# Altium schematic sheet MS1050_EVB_V2.0.SchDoc
size 381 x 203 mm; SheetNumber: 1; SheetTotal: 1
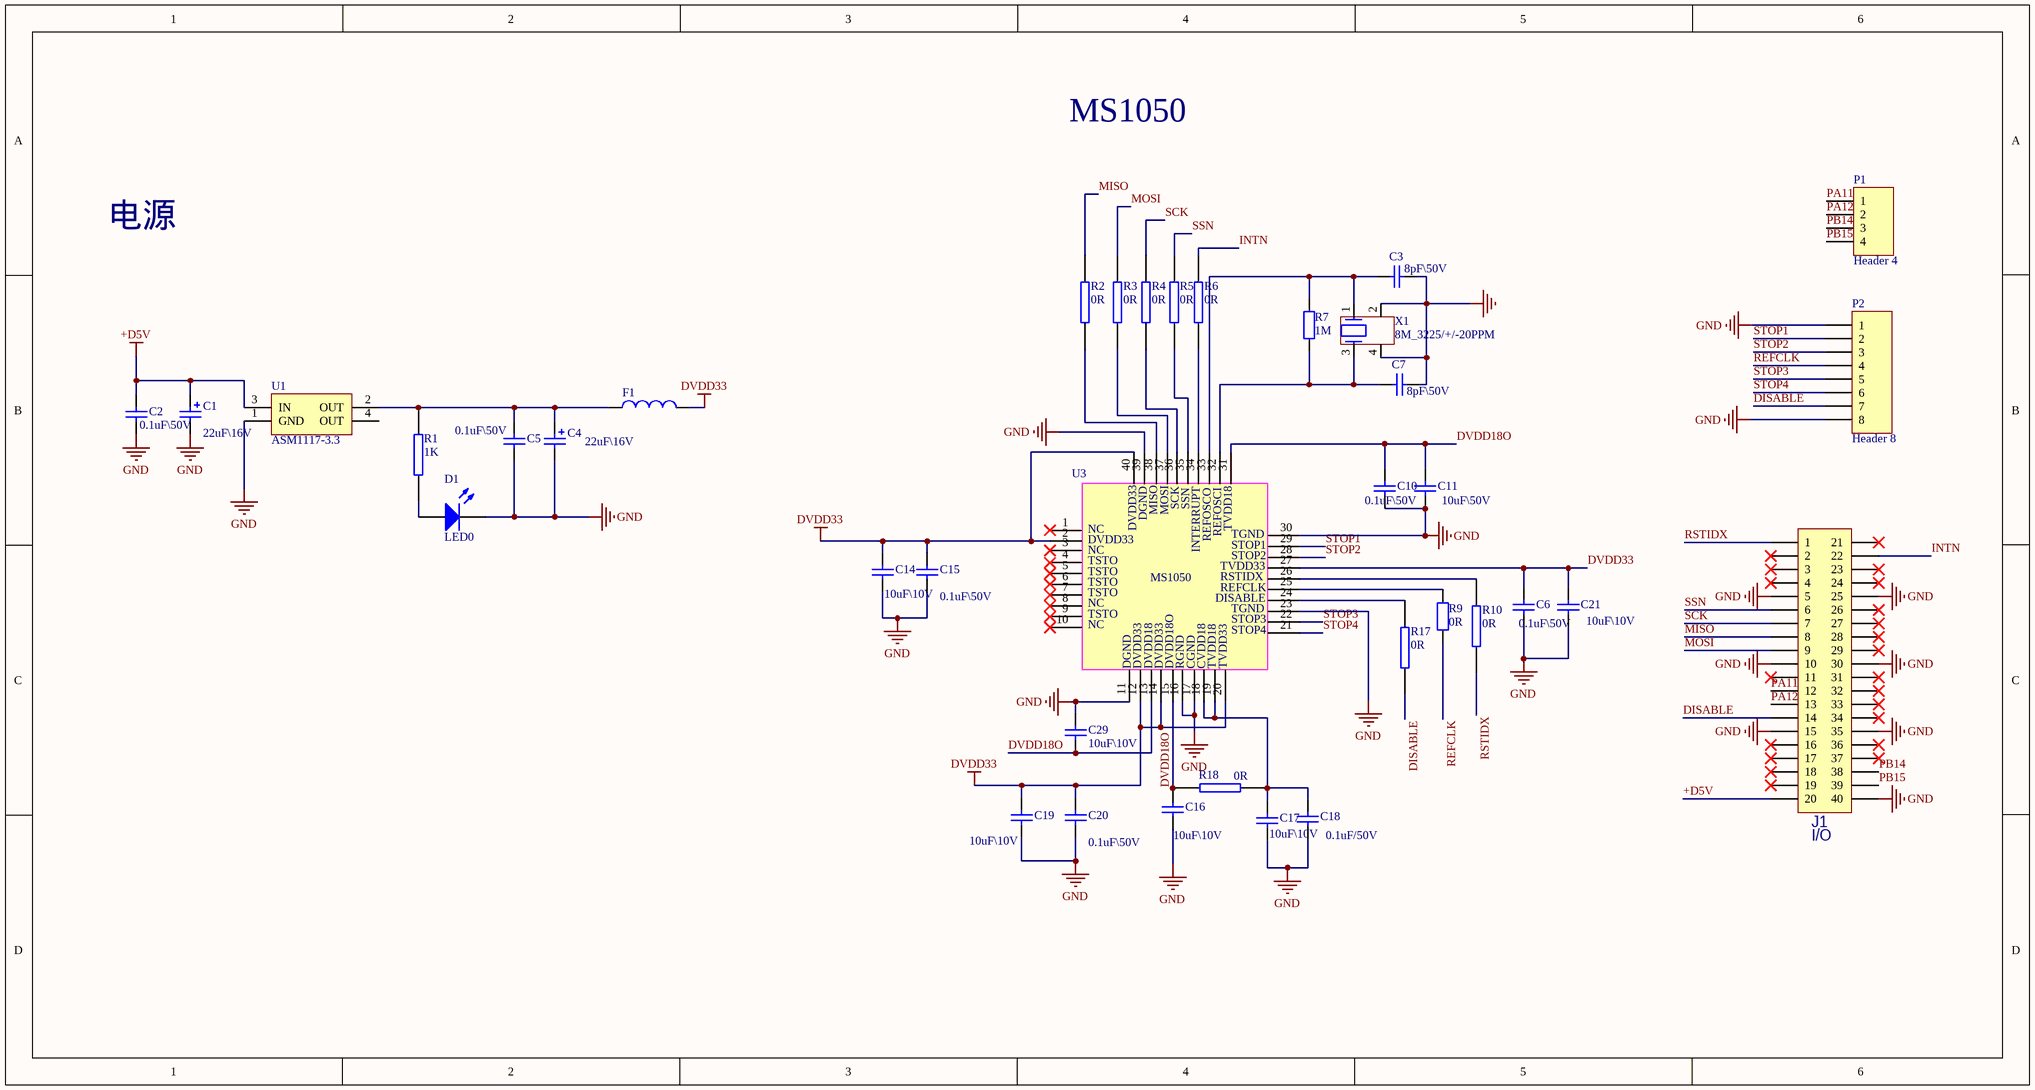
[diagram p0: MS1050_EVB_V2.0.SchDoc]

## Parts
C1  value 22uF\16V  [3216]  (hidden comment: 22uF)
C2  value 0.1uF\50V  [0603C]  (hidden comment: 0.1uF)
C3  value 8pF\50V  [0603C]  (hidden comment: 8pF)
C4  value 22uF\16V  [3216]  (hidden comment: 22uF)
C5  value 0.1uF\50V  [0603c]  (hidden comment: 0.1uF)
C6  value 0.1uF\50V  [0603c]  (hidden comment: 0.1uF)
C7  value 8pF\50V  [0603C]  (hidden comment: 8pF)
C10  value 0.1uF\50V  [0603c]  (hidden comment: 0.1uF)
C11  value 10uF\50V  [0603c]  (hidden comment: 10uF)
C14  value 10uF\10V  [0603c]  (hidden comment: 10uF)
C15  value 0.1uF\50V  [0603c]  (hidden comment: 0.1uF)
C16  value 10uF\10V  [0603c]  (hidden comment: 10uF)
C17  value 10uF\10V  [0603c]  (hidden comment: 10uF)
C18  value 0.1uF/50V  [0603c]  (hidden comment: 0.1uF)
C19  value 10uF\10V  [0603c]  (hidden comment: 10uF)
C20  value 0.1uF\50V  [0603c]  (hidden comment: 0.1uF)
C21  value 10uF\10V  [0603c]  (hidden comment: 10uF)
C29  value 10uF\10V  [0603c]  (hidden comment: 10uF)
D1  LED0  [LED 0603R]
F1  (no value)  [R0603]
J1  I/O  [SIP20x2B]
P1  Header 4  [HDR1X4]
P2  Header 8  [HDR1X8]
R1  1K  [R0603]
R2  0R  [R0603]
R3  0R  [R0603]
R4  0R  [R0603]
R5  0R  [R0603]
R6  0R  [R0603]
R7  1M  [R0603]
R9  value 0R  [R0603]  (hidden comment: Res2)
R10  0R  [R0603]
R17  0R  [R0603]
R18  0R  [R0603]
U1  ASM1117-3.3  [1117]
U3  MS1050  [QFN40 6X6_L]
X1  value 8M_3225/+/-20PPM  [OSC 4025-4P]  (hidden comment: XTAL_4_PINS)

## Nets
+D5V: C1.1 C2.2 J1.20 U1.3(IN)
DVDD33: C6.1 C14.2 C15.2 C19.2 C20.2 C21.1 F1.2 U3.2 U3.12 U3.14 U3.20 U3.27 U3.40
GND: C1.2 C2.1 C3.2 C4.2 C5.1 C6.2 C7.2 C10.1 C11.2 C14.1 C15.1 C16.1 C17.1 C18.1 C19.1 C20.1 C21.2 C29.2 D1.2(K) J1.5 J1.10 J1.15 J1.25 J1.30 J1.35 J1.40 P2.1 P2.8 U1.1(GND) U3.11 U3.16 U3.17 U3.23 U3.30 U3.39 X1.2 X1.4
DISABLE: J1.14 P2.7 R17.2
DVDD18O: C10.2 C11.1 C16.2 C29.1 R18.1 U3.13 U3.15 U3.31
INTN: J1.22 R6.2
MISO: J1.8 R2.2
MOSI: J1.9 R3.2
PA11: J1.12 P1.1
PA12: J1.13 P1.2
PB14: J1.38 P1.3
PB15: J1.39 P1.4
REFCLK: P2.4 R9.1
RSTIDX: J1.1 R10.2
SCK: J1.7 R4.2
SSN: J1.6 R5.2
STOP1: P2.2 U3.29
STOP2: P2.3 U3.28
STOP3: P2.5 U3.22
STOP4: P2.6 U3.21
NetC3_1: C3.1 R7.1 U3.33 X1.1
NetC4_1: C4.1 C5.2 F1.1 R1.1 U1.2(OUT)
NetC7_1: C7.1 R7.2 U3.32 X1.3
NetC17_2: C17.2 C18.2 R18.2 U3.18 U3.19
NetD1_1: D1.1(A) R1.2
NetR2_1: R2.1 U3.38
NetR3_1: R3.1 U3.37
NetR4_1: R4.1 U3.36
NetR5_1: R5.1 U3.35
NetR6_1: R6.1 U3.34
NetR9_2: R9.2 U3.25
NetR10_1: R10.1 U3.26
NetR17_1: R17.1 U3.24

Not connected (* = marked no-connect by the designer): J1 2* 3* 4* 11* 16* 17* 18* 19* 21* 23* 24* 26* 27* 28* 29* 31* 32* 33* 34* 36* 37*; U1 4(OUT); U3 1* 3* 4* 5* 6* 7* 8* 9* 10*

## Notes on the sheet
- MS1050
- 电源
- (in symbol MS1050) SCK; SSN; DGND; MISO; MOSI; DVDD33; TVDD18; NC; REFOSCI; REFOSCO; TGND; INTERRUPT; STOP1; TSTO; STOP2; TVDD33; RSTIDX; REFCLK; DISABLE; STOP3; STOP4; DVDD18; DVDD18O; RGND; CGND; CVDD18

## Library data of the parts
C1 C4 = Cap Pol2: Cap，22uF，20%，3216; Published: 8-Jun-2000; LatestRevisionDate: 17-Jul-2002; LatestRevisionNote: Re-released for DXP Platform.; PackageReference: POLAR0.8; Publisher: Altium Limited; PackageDescription: Polarized Capacitor; 2 Leads
C2 = Cap: Cap，0.1 uF，1%，0603; Published: 8-Jun-2000; LatestRevisionDate: 17-Jul-2002; LatestRevisionNote: Re-released for DXP Platform.; PackageReference: RAD-0.3; Publisher: Altium Limited; PackageDescription: Radial Cap, Thru-Hole; 2 Leads; 0.3 in Pin Spacing
C3 C7 = Cap: Cap，8pF，1%，0603; Published: 8-Jun-2000; LatestRevisionDate: 17-Jul-2002; LatestRevisionNote: Re-released for DXP Platform.; PackageReference: RAD-0.3; Publisher: Altium Limited; PackageDescription: Radial Cap, Thru-Hole; 2 Leads; 0.3 in Pin Spacing
C5 C6 C10 C15 C18 C20 = Cap: Cap，0.1uF，1%，0603; Published: 8-Jun-2000; LatestRevisionDate: 17-Jul-2002; LatestRevisionNote: Re-released for DXP Platform.; PackageReference: RAD-0.3; Publisher: Altium Limited; PackageDescription: Radial Cap, Thru-Hole; 2 Leads; 0.3 in Pin Spacing
C11 C14 C16 C17 C19 C21 C29 = Cap: Cap，10 uF，1%，0603; Published: 8-Jun-2000; LatestRevisionDate: 17-Jul-2002; LatestRevisionNote: Re-released for DXP Platform.; PackageReference: RAD-0.3; Publisher: Altium Limited; PackageDescription: Radial Cap, Thru-Hole; 2 Leads; 0.3 in Pin Spacing
D1 = LED0: Green LED; Published: 8-Jun-2000; LatestRevisionDate: 08-Jul-2005; LatestRevisionNote: Mech Layer 1 removed.; PackageReference: LED-0; Publisher: Altium Limited; PackageDescription: LED; 2 Leads
F1 = Inductor: Code_IEC: 1005; Published: 8-Jun-2000; LatestRevisionDate: 29-May-2009; LatestRevisionNote: IPC-7351 Footprint Added.; PackageReference: 0402-A; Publisher: Altium Limited; PackageDescription: Chip Inductor; Code_JEITA: 0402
J1 = Header 20X2A: Header, 40-Pin, Dual row; LatestRevisionDate: *; LatestRevisionNote: *; Publisher: *
P1 = Header 4: Header, 4-Pin; LatestRevisionDate: 17-Jul-2002; LatestRevisionNote: Re-released for DXP Platform.; Publisher: Altium Limited
P2 = Header 8: Header, 8-Pin; LatestRevisionDate: 17-Jul-2002; LatestRevisionNote: Re-released for DXP Platform.; Publisher: Altium Limited
R1 = RES2: RES，1.00K ohm，1%，0.125W，0603
R2-R6 R10 R17 R18 = RES2_1: RES，0 ohm，1%，0.125W，0603
R7 = Res2: RES，1M ohm，1%，0.125W，0603; Published: 8-Jun-2000; LatestRevisionDate: 17-Jul-2002; LatestRevisionNote: Re-released for DXP Platform.; PackageReference: AXIAL-0.4; Publisher: Altium Limited; PackageDescription: Axial Device, Thru-Hole; 2 Leads; 0.4 in Pin Spacing; Value: 1M
R9 = Res2_3: Resistor; Published: 8-Jun-2000; LatestRevisionDate: 17-Jul-2002; LatestRevisionNote: Re-released for DXP Platform.; PackageReference: AXIAL-0.4; Publisher: Altium Limited; PackageDescription: Axial Device, Thru-Hole; 2 Leads; 0.4 in Pin Spacing
U1 = REG1117-3.3: 800mA and 1A Low Dropout Positive Regulator 2.85V, 3.3V, 5V, and Adjustable; Published: 8-Jun-2000; LatestRevisionDate: 17-Jul-2002; LatestRevisionNote: Re-released for DXP Platform.; DatasheetVersion: Sep-1997; PackageVersion: revC; PackageReference: ZZ311; Publisher: Altium Limited; PackageDescription: SOT-223/SC-73; 4 Leads; Body 6.7 x 7.3 mm, inc. leads (LxW max); ComponentLink1Description: Manufacturer Link; ComponentLink1URL: http://www.ti.com/; ComponentLink2Description: Datasheet; ComponentLink2URL: http://www-s.ti.com/sc/ds/REG1117.pdf
X1 = XTAL_4_PINS: SMD3225, 8MHz, 12pF 10%; Manufacturer: SJK; PartNumber: 7U08000E12UCG; Package: (2016) 2.0 x 1.6 x 0.45 mm